# Altium schematic sheet LCD.SchDoc
size A
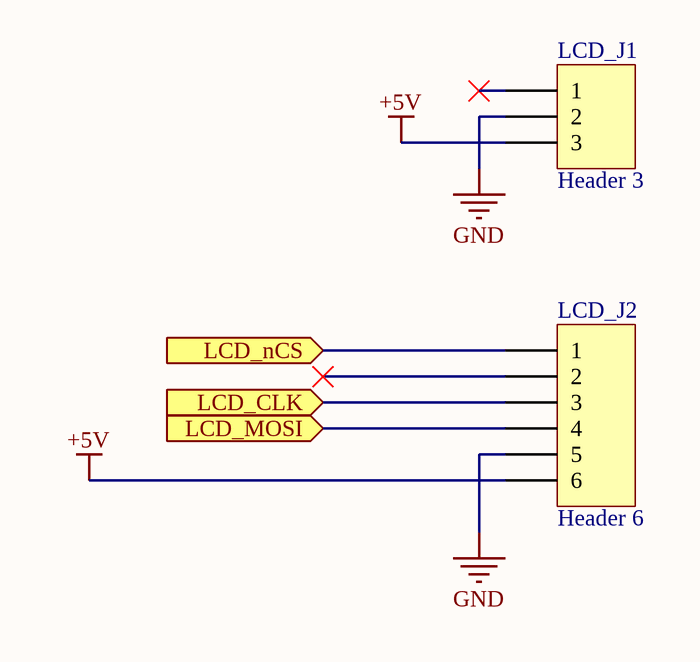
[diagram p0: LCD.SchDoc]

## Parts
LCD_J1  Header 3  [HDR1X3]
LCD_J2  Header 6  [HDR1X6]

## Ports
LCD_CLK (in), LCD_MOSI (in), LCD_nCS (in)

## Nets
+5V: LCD_J1.3 LCD_J2.6
GND: LCD_J1.2 LCD_J2.5
LCD_CLK: LCD_J2.3 ; port LCD_CLK
LCD_MOSI: LCD_J2.4 ; port LCD_MOSI
LCD_nCS: LCD_J2.1 ; port LCD_nCS

Not connected (* = marked no-connect by the designer): LCD_J1 1*; LCD_J2 2*

## Library data of the parts
LCD_J1 = Header 3: Header, 3-Pin; LatestRevisionDate: 17-Jul-2002; LatestRevisionNote: Re-released for DXP Platform.; Publisher: Altium Limited
LCD_J2 = Header 6: Header, 6-Pin; LatestRevisionDate: 17-Jul-2002; LatestRevisionNote: Re-released for DXP Platform.; Publisher: Altium Limited